# EAGLE schematic txs0108e (EAGLE 6.4)
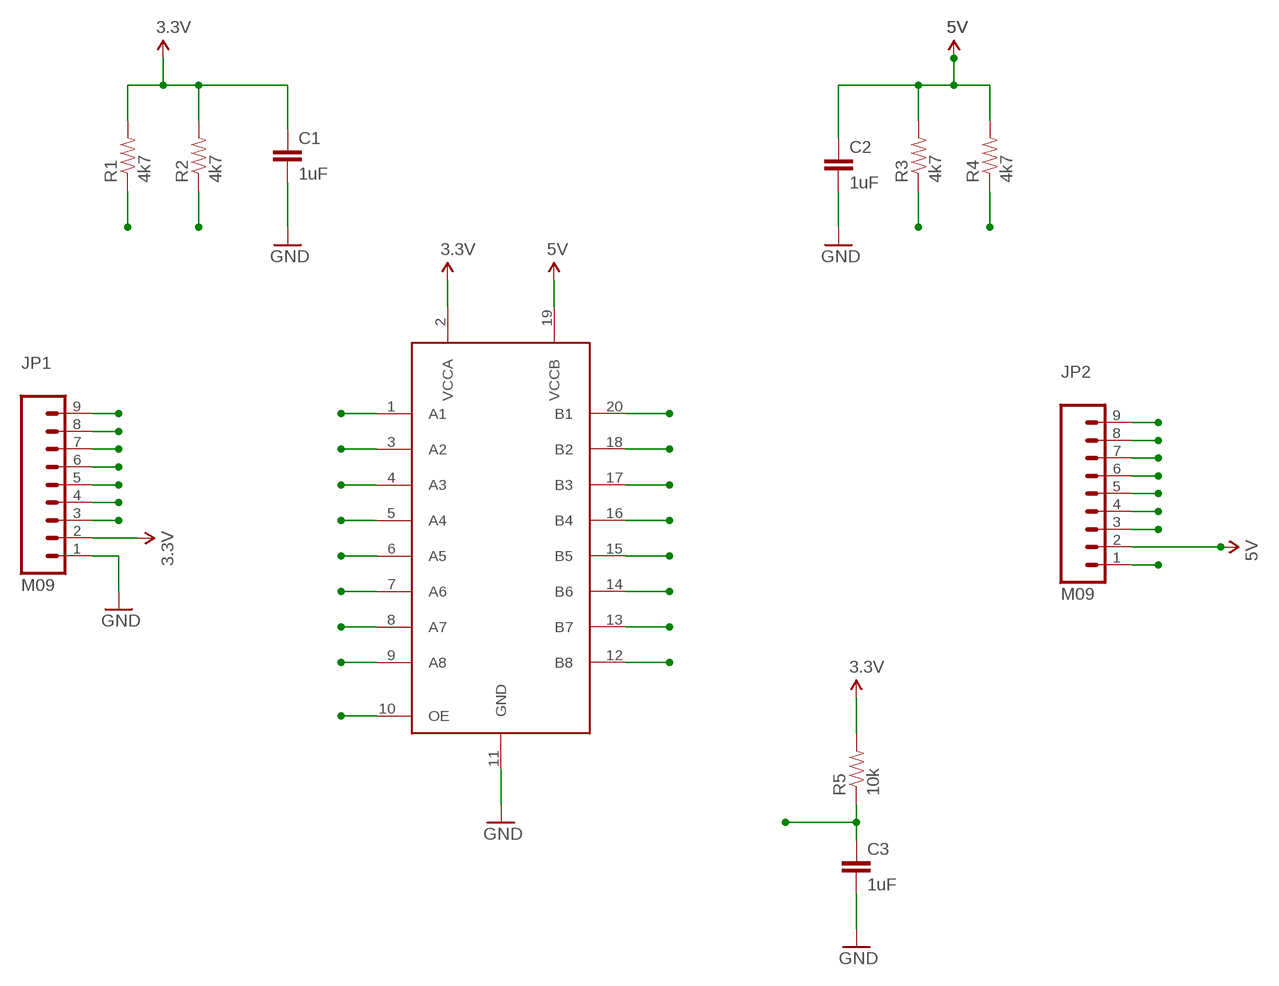
[diagram p0: schematic, sheet 1]

## Parts
C1  1uF  CAP0603-CAP  [0603-CAP]
C2  1uF  CAP0603-CAP  [0603-CAP]
C3  1uF  CAP0603-CAP  [0603-CAP]
JP1  M09  [1X09]
JP2  M09  [1X09]
R1  4k7  RESISTOR0603-RES  [0603-RES]
R2  4k7  RESISTOR0603-RES  [0603-RES]
R3  4k7  RESISTOR0603-RES  [0603-RES]
R4  4k7  RESISTOR0603-RES  [0603-RES]
R5  10k  RESISTOR0603-RES  [0603-RES]
U$1  TXS0108E  [TSSOP20]

## Nets
3.3V: C1.1 JP1.2 R1.2 R2.2 R5.2 U$1.2(VCCA)
5V: C2.1 JP2.2 R3.2 R4.2 U$1.19(VCCB)
A1: JP1.3 R1.1 U$1.1(A1)
A2: JP1.4 R2.1 U$1.3(A2)
A3: JP1.5 U$1.4(A3)
A4: JP1.6 U$1.5(A4)
A5: JP1.7 U$1.6(A5)
A6: JP1.8 U$1.7(A6)
A7: JP1.9 U$1.8(A7)
A8: U$1.9(A8)
B1: JP2.3 R3.1 U$1.20(B1)
B2: JP2.4 R4.1 U$1.18(B2)
B3: JP2.5 U$1.17(B3)
B4: JP2.6 U$1.16(B4)
B5: JP2.7 U$1.15(B5)
B6: JP2.8 U$1.14(B6)
B7: JP2.9 U$1.13(B7)
B8: U$1.12(B8)
GND: C1.2 C2.2 C3.2 JP1.1 U$1.11(GND)
N$2: JP2.1
OE: C3.1 R5.1 U$1.10(OE)

## Library data of the parts
C1-C3 = SparkFun-Passives:CAP: Capacitor Standard 0603 ceramic capacitor, and 0.1" leaded capacitor.
JP1 JP2 = SparkFun-Connectors:M09: Header 9 Standard 9-pin 0.1" header. Use with straight break away headers (SKU : PRT-00116), right angle break away headers (PRT-00553), swiss pins (PRT-00743), machine pins (PRT-00117), and female headers (PRT-00115).
R1-R5 = SparkFun-Passives:RESISTOR: Resistor Basic schematic elements and footprints for 0603, 1206, and PTH resistors.
U$1 = Synapseware:TXS0108E